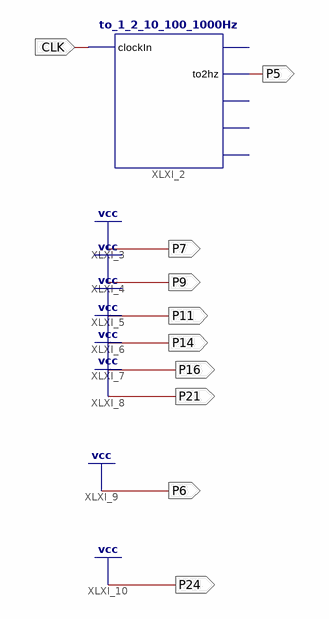
[diagram p0: schematic sheet 1]
// Xilinx ISE schematic Main.sch (spartan6) as structural Verilog: 1 symbols, 10 ports
module Main (
  input  CLK,
  output P5,
  output P7,
  output P9,
  output P11,
  output P14,
  output P16,
  output P21,
  output P6,
  output P24
);

  to_1_2_10_100_1000Hz XLXI_2 (.clockIn(CLK), .to2hz(P5));  // open: to1hz, to10hz, to100hz, to1000hz

  assign P6 = 1'b1;
  assign P7 = 1'b1;
  assign P9 = 1'b1;
  assign P11 = 1'b1;
  assign P14 = 1'b1;
  assign P16 = 1'b1;
  assign P21 = 1'b1;
  assign P24 = 1'b1;
endmodule
